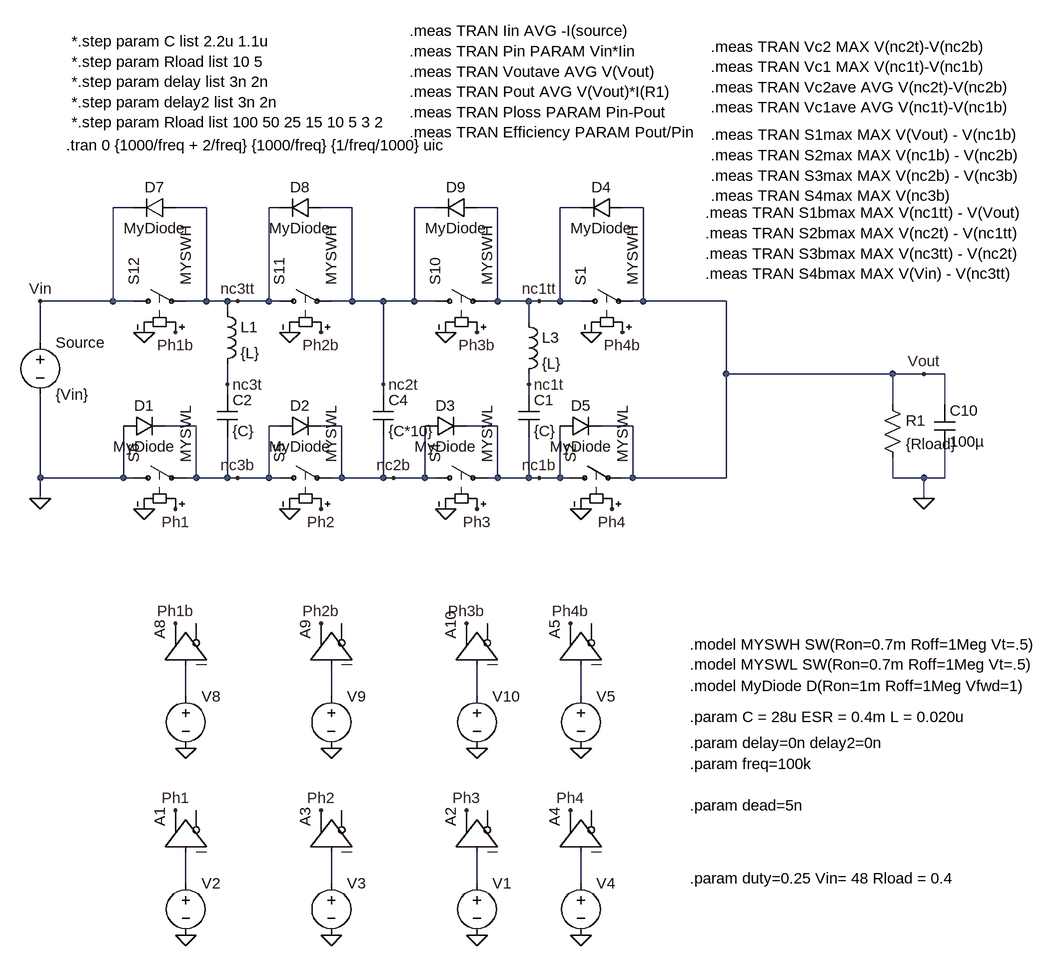
[diagram p0: schematic 5level_48V_distribuated.asc]
5level_48V_distribuated.asc, the LTspice schematic file:
Version 4
SHEET 1 1904 1428
WIRE -1152 -64 -1184 -64
WIRE -1040 -64 -1088 -64
WIRE -928 -64 -944 -64
WIRE -816 -64 -864 -64
WIRE -688 -64 -720 -64
WIRE -592 -64 -624 -64
WIRE -464 -64 -496 -64
WIRE -368 -64 -400 -64
WIRE -1184 80 -1184 -64
WIRE -1184 80 -1296 80
WIRE -1152 80 -1184 80
WIRE -1040 80 -1040 -64
WIRE -1040 80 -1072 80
WIRE -1008 80 -1040 80
WIRE -992 80 -1008 80
WIRE -944 80 -944 -64
WIRE -944 80 -992 80
WIRE -928 80 -944 80
WIRE -816 80 -816 -64
WIRE -816 80 -848 80
WIRE -768 80 -816 80
WIRE -720 80 -720 -64
WIRE -720 80 -768 80
WIRE -688 80 -720 80
WIRE -592 80 -592 -64
WIRE -592 80 -608 80
WIRE -544 80 -592 80
WIRE -528 80 -544 80
WIRE -496 80 -496 -64
WIRE -496 80 -528 80
WIRE -464 80 -496 80
WIRE -368 80 -368 -64
WIRE -368 80 -384 80
WIRE -240 80 -368 80
WIRE -1008 96 -1008 80
WIRE -544 112 -544 80
WIRE -1296 144 -1296 80
WIRE -240 192 -240 80
WIRE 16 192 -240 192
WIRE 64 192 16 192
WIRE 96 192 64 192
WIRE -1008 208 -1008 176
WIRE -768 208 -768 80
WIRE -544 208 -544 192
WIRE -1008 224 -1008 208
WIRE -768 224 -768 208
WIRE -544 224 -544 208
WIRE 16 240 16 192
WIRE 96 240 96 192
WIRE -1056 272 -1104 272
WIRE -928 272 -944 272
WIRE -832 272 -864 272
WIRE -592 272 -640 272
WIRE -384 272 -432 272
WIRE -1296 352 -1296 224
WIRE -1168 352 -1168 272
WIRE -1168 352 -1296 352
WIRE -1152 352 -1168 352
WIRE -1056 352 -1056 272
WIRE -1056 352 -1072 352
WIRE -1008 352 -1008 288
WIRE -1008 352 -1056 352
WIRE -992 352 -1008 352
WIRE -944 352 -944 272
WIRE -944 352 -992 352
WIRE -928 352 -944 352
WIRE -832 352 -832 272
WIRE -832 352 -848 352
WIRE -768 352 -768 288
WIRE -768 352 -832 352
WIRE -752 352 -768 352
WIRE -704 352 -704 272
WIRE -704 352 -752 352
WIRE -688 352 -704 352
WIRE -592 352 -592 272
WIRE -592 352 -608 352
WIRE -544 352 -544 288
WIRE -544 352 -592 352
WIRE -528 352 -544 352
WIRE -496 352 -496 272
WIRE -496 352 -528 352
WIRE -480 352 -496 352
WIRE -384 352 -384 272
WIRE -384 352 -400 352
WIRE -240 352 -240 192
WIRE -240 352 -384 352
WIRE 16 352 16 320
WIRE 64 352 16 352
WIRE 96 352 96 304
WIRE 96 352 64 352
WIRE -1296 384 -1296 352
WIRE 64 384 64 352
WIRE -1072 688 -1072 640
WIRE -848 688 -848 640
WIRE -624 688 -624 640
WIRE -464 688 -464 640
WIRE -1072 976 -1072 928
WIRE -848 976 -848 928
WIRE -624 976 -624 928
WIRE -464 976 -464 928
FLAG -1072 1056 0
FLAG -1088 864 Ph1
FLAG -1296 80 Vin
FLAG -624 128 Ph3b
FLAG -864 128 Ph2b
FLAG -1088 128 Ph1b
FLAG -1136 128 0
FLAG -912 128 0
FLAG -672 128 0
FLAG -848 1056 0
FLAG -864 864 Ph2
FLAG -624 400 Ph3
FLAG -864 400 Ph2
FLAG -1088 400 Ph1
FLAG -1136 400 0
FLAG -912 400 0
FLAG -672 400 0
FLAG 64 384 0
FLAG -1296 384 0
FLAG -624 1056 0
FLAG -640 864 Ph3
FLAG -1072 768 0
FLAG -1088 576 Ph1b
FLAG -848 768 0
FLAG -864 576 Ph2b
FLAG -624 768 0
FLAG -640 576 Ph3b
FLAG -992 80 nc3tt
FLAG -992 352 nc3b
FLAG -752 352 nc2b
FLAG -400 128 Ph4b
FLAG -448 128 0
FLAG -416 400 Ph4
FLAG -464 400 0
FLAG -528 80 nc1tt
FLAG -528 352 nc1b
FLAG -464 1056 0
FLAG -480 864 Ph4
FLAG -464 768 0
FLAG -480 576 Ph4b
FLAG 64 192 Vout
FLAG -1008 208 nc3t
FLAG -768 208 nc2t
FLAG -544 208 nc1t
SYMBOL voltage -1072 960 R0
WINDOW 123 0 0 Left 2
WINDOW 39 0 0 Left 2
WINDOW 3 24 96 Invisible 2
SYMATTR Value PULSE(0 1 0 1p 1p {1/freq*(1-duty)} {1/freq})
SYMATTR InstName V2
SYMBOL Digital\\buf -1136 928 R270
SYMATTR InstName A1
SYMBOL voltage -1296 128 R0
WINDOW 123 0 0 Left 2
WINDOW 39 0 0 Left 2
SYMATTR InstName Source
SYMATTR Value {Vin}
SYMBOL sw -704 80 R270
SYMATTR InstName S10
SYMATTR Value MYSWH
SYMBOL sw -944 80 R270
SYMATTR InstName S11
SYMATTR Value MYSWH
SYMBOL sw -1168 80 R270
SYMATTR InstName S12
SYMATTR Value MYSWH
SYMBOL voltage -848 960 R0
WINDOW 123 0 0 Left 2
WINDOW 39 0 0 Left 2
WINDOW 3 24 96 Invisible 2
SYMATTR Value PULSE(0 1 {1/freq/4+delay} 1p 1p {1/freq*(1-duty)-delay+delay2} {1/freq})
SYMATTR InstName V3
SYMBOL Digital\\buf -912 928 R270
SYMATTR InstName A3
SYMBOL sw -704 352 R270
SYMATTR InstName S4
SYMATTR Value MYSWL
SYMBOL sw -944 352 R270
SYMATTR InstName S5
SYMATTR Value MYSWL
SYMBOL sw -1168 352 R270
SYMATTR InstName S6
SYMATTR Value MYSWL
SYMBOL cap -1024 224 R0
SYMATTR InstName C2
SYMATTR Value {C}
SYMATTR SpiceLine Rser={ESR}
SYMATTR SpiceLine2 IC={Vin/3*1}
SYMBOL cap -784 224 R0
SYMATTR InstName C4
SYMATTR Value {C*10}
SYMATTR SpiceLine Rser={ESR}
SYMATTR SpiceLine2 IC={Vin/3*2}
SYMBOL res 0 224 R0
SYMATTR InstName R1
SYMATTR Value {Rload}
SYMBOL cap 80 240 R0
SYMATTR InstName C10
SYMATTR Value 100µ
SYMATTR SpiceLine IC={Vin*duty}
SYMATTR SpiceLine2 Rser={ESR}
SYMBOL voltage -624 960 R0
WINDOW 123 0 0 Left 2
WINDOW 39 0 0 Left 2
WINDOW 3 24 96 Invisible 2
SYMATTR Value PULSE(0 1 {2/freq/4} 1p 1p {1/freq*(1-duty)} {1/freq})
SYMATTR InstName V1
SYMBOL Digital\\buf -688 928 R270
SYMATTR InstName A2
SYMBOL voltage -1072 672 R0
WINDOW 123 0 0 Left 2
WINDOW 39 0 0 Left 2
WINDOW 3 24 96 Invisible 2
SYMATTR Value PULSE(0 1 {1/freq*(1-duty)+dead+delay} 1p 1p {1/freq*duty-dead*2-delay+delay2} {1/freq})
SYMATTR InstName V8
SYMBOL Digital\\buf -1136 640 R270
SYMATTR InstName A8
SYMBOL voltage -848 672 R0
WINDOW 123 0 0 Left 2
WINDOW 39 0 0 Left 2
WINDOW 3 24 96 Invisible 2
SYMATTR Value PULSE(0 1 {1/freq/4+1/freq*(1-duty)+dead} 1p 1p {1/freq*duty-dead*2} {1/freq})
SYMATTR InstName V9
SYMBOL Digital\\buf -912 640 R270
SYMATTR InstName A9
SYMBOL voltage -624 672 R0
WINDOW 123 0 0 Left 2
WINDOW 39 0 0 Left 2
WINDOW 3 24 44 Invisible 2
SYMATTR Value PULSE(0 1 {2/freq/4+1/freq*(1-duty)+dead+delay} 1p 1p {1/freq*duty-dead*2-delay+delay2} {1/freq})
SYMATTR InstName V10
SYMBOL Digital\\buf -688 640 R270
SYMATTR InstName A10
SYMBOL diode -1168 288 R270
WINDOW 0 32 32 VTop 2
WINDOW 3 0 32 VBottom 2
SYMATTR InstName D1
SYMATTR Value MyDiode
SYMBOL diode -928 288 R270
WINDOW 0 32 32 VTop 2
WINDOW 3 0 32 VBottom 2
SYMATTR InstName D2
SYMATTR Value MyDiode
SYMBOL diode -704 288 R270
WINDOW 0 32 32 VTop 2
WINDOW 3 0 32 VBottom 2
SYMATTR InstName D3
SYMATTR Value MyDiode
SYMBOL diode -1088 -80 R90
WINDOW 0 0 32 VBottom 2
WINDOW 3 32 32 VTop 2
SYMATTR InstName D7
SYMATTR Value MyDiode
SYMBOL diode -864 -80 R90
WINDOW 0 0 32 VBottom 2
WINDOW 3 32 32 VTop 2
SYMATTR InstName D8
SYMATTR Value MyDiode
SYMBOL diode -624 -80 R90
WINDOW 0 0 32 VBottom 2
WINDOW 3 32 32 VTop 2
SYMATTR InstName D9
SYMATTR Value MyDiode
SYMBOL sw -480 80 R270
SYMATTR InstName S1
SYMATTR Value MYSWH
SYMBOL diode -400 -80 R90
WINDOW 0 0 32 VBottom 2
WINDOW 3 32 32 VTop 2
SYMATTR InstName D4
SYMATTR Value MyDiode
SYMBOL sw -496 352 R270
SYMATTR InstName S2
SYMATTR Value MYSWL
SYMBOL diode -496 288 R270
WINDOW 0 32 32 VTop 2
WINDOW 3 0 32 VBottom 2
SYMATTR InstName D5
SYMATTR Value MyDiode
SYMBOL cap -560 224 R0
SYMATTR InstName C1
SYMATTR Value {C}
SYMATTR SpiceLine Rser={ESR}
SYMATTR SpiceLine2 IC={Vin/3*2}
SYMBOL voltage -464 960 R0
WINDOW 123 0 0 Left 2
WINDOW 39 0 0 Left 2
WINDOW 3 24 96 Invisible 2
SYMATTR Value PULSE(0 1 {3/freq/4} 1p 1p {1/freq*(1-duty)} {1/freq})
SYMATTR InstName V4
SYMBOL Digital\\buf -528 928 R270
SYMATTR InstName A4
SYMBOL voltage -464 672 R0
WINDOW 123 0 0 Left 2
WINDOW 39 0 0 Left 2
WINDOW 3 24 44 Invisible 2
SYMATTR Value PULSE(0 1 {3/freq/4+1/freq*(1-duty)+dead+delay} 1p 1p {1/freq*duty-dead*2-delay+delay2} {1/freq})
SYMATTR InstName V5
SYMBOL Digital\\buf -528 640 R270
SYMATTR InstName A5
SYMBOL ind -1024 80 R0
SYMATTR InstName L1
SYMATTR Value {L}
SYMATTR SpiceLine Rser=0.2m Rpar=1k
SYMATTR SpiceLine2 ic = {Vin*duty/Rload}
SYMBOL ind -560 96 R0
SYMATTR InstName L3
SYMATTR Value {L}
SYMATTR SpiceLine Rser=0.2m Rpar=1k
SYMATTR SpiceLine2 ic = {Vin*duty/Rload}
TEXT -1256 -160 Left 2 !.tran 0 {1000/freq + 2/freq} {1000/freq} {1/freq/1000} uic
TEXT -296 608 Left 2 !.model MYSWH SW(Ron=0.7m Roff=1Meg Vt=.5)\n.model MYSWL SW(Ron=0.7m Roff=1Meg Vt=.5)
TEXT -296 672 Left 2 !.model MyDiode D(Ron=1m Roff=1Meg Vfwd=1)
TEXT -296 760 Left 2 !.param delay=0n delay2=0n
TEXT -296 792 Left 2 !.param freq=100k
TEXT -296 968 Left 2 !.param duty=0.25 Vin= 48 Rload = 0.4
TEXT -296 856 Left 2 !.param dead=5n
TEXT -296 720 Left 2 !.param C = 28u ESR = 0.4m L = 0.020u
TEXT -264 -176 Left 2 !.meas TRAN S1max MAX V(Vout) - V(nc1b)\n.meas TRAN S2max MAX V(nc1b) - V(nc2b)\n.meas TRAN S3max MAX V(nc2b) - V(nc3b)\n.meas TRAN S4max MAX V(nc3b)
TEXT -264 -312 Left 2 !.meas TRAN Vc2 MAX V(nc2t)-V(nc2b)\n.meas TRAN Vc1 MAX V(nc1t)-V(nc1b)\n.meas TRAN Vc2ave AVG V(nc2t)-V(nc2b)\n.meas TRAN Vc1ave AVG V(nc1t)-V(nc1b)
TEXT -272 -56 Left 2 !.meas TRAN S1bmax MAX V(nc1tt) - V(Vout) \n.meas TRAN S2bmax MAX V(nc2t) - V(nc1tt) \n.meas TRAN S3bmax MAX V(nc3tt) - V(nc2t)\n.meas TRAN S4bmax MAX V(Vin) - V(nc3tt)
TEXT -1248 -320 Left 2 !*.step param C list 2.2u 1.1u\n*.step param Rload list 10 5\n*.step param delay list 3n 2n\n*.step param delay2 list 3n 2n\n*.step param Rload list 100 50 25 15 10 5 3 2
TEXT -728 -336 Left 2 !.meas TRAN Iin AVG -I(source)\n.meas TRAN Pin PARAM Vin*Iin\n.meas TRAN Voutave AVG V(Vout)\n.meas TRAN Pout AVG V(Vout)*I(R1)\n.meas TRAN Ploss PARAM Pin-Pout\n.meas TRAN Efficiency PARAM Pout/Pin

The netlist it stands for:
* 5level_48V_distribuated.asc
V2 N005 0 PULSE(0 1 0 1p 1p {1/freq*(1-duty)} {1/freq})
A1 N005 0 0 0 0 0 Ph1 0 BUF
V§Source Vin 0 {Vin}
S10 nc2t nc1tt Ph3b 0 MYSWH
S11 nc3tt nc2t Ph2b 0 MYSWH
S12 Vin nc3tt Ph1b 0 MYSWH
V3 N006 0 PULSE(0 1 {1/freq/4+delay} 1p 1p {1/freq*(1-duty)-delay+delay2} {1/freq})
A3 N006 0 0 0 0 0 Ph2 0 BUF
S4 nc2b nc1b Ph3 0 MYSWL
S5 nc3b nc2b Ph2 0 MYSWL
S6 0 nc3b Ph1 0 MYSWL
C2 nc3t nc3b {C} Rser={ESR} IC={Vin/3*1}
C4 nc2t nc2b {C*10} Rser={ESR} IC={Vin/3*2}
R1 Vout 0 {Rload}
C10 Vout 0 100µ IC={Vin*duty} Rser={ESR}
V1 N007 0 PULSE(0 1 {2/freq/4} 1p 1p {1/freq*(1-duty)} {1/freq})
A2 N007 0 0 0 0 0 Ph3 0 BUF
V8 N001 0 PULSE(0 1 {1/freq*(1-duty)+dead+delay} 1p 1p {1/freq*duty-dead*2-delay+delay2} {1/freq})
A8 N001 0 0 0 0 0 Ph1b 0 BUF
V9 N002 0 PULSE(0 1 {1/freq/4+1/freq*(1-duty)+dead} 1p 1p {1/freq*duty-dead*2} {1/freq})
A9 N002 0 0 0 0 0 Ph2b 0 BUF
V10 N003 0 PULSE(0 1 {2/freq/4+1/freq*(1-duty)+dead+delay} 1p 1p {1/freq*duty-dead*2-delay+delay2} {1/freq})
A10 N003 0 0 0 0 0 Ph3b 0 BUF
D1 0 nc3b MyDiode
D2 nc3b nc2b MyDiode
D3 nc2b nc1b MyDiode
D7 nc3tt Vin MyDiode
D8 nc2t nc3tt MyDiode
D9 nc1tt nc2t MyDiode
S1 nc1tt Vout Ph4b 0 MYSWH
D4 Vout nc1tt MyDiode
S2 nc1b Vout Ph4 0 MYSWL
D5 nc1b Vout MyDiode
C1 nc1t nc1b {C} Rser={ESR} IC={Vin/3*2}
V4 N008 0 PULSE(0 1 {3/freq/4} 1p 1p {1/freq*(1-duty)} {1/freq})
A4 N008 0 0 0 0 0 Ph4 0 BUF
V5 N004 0 PULSE(0 1 {3/freq/4+1/freq*(1-duty)+dead+delay} 1p 1p {1/freq*duty-dead*2-delay+delay2} {1/freq})
A5 N004 0 0 0 0 0 Ph4b 0 BUF
L1 nc3tt nc3t {L} Rser=0.2m Rpar=1k ic = {Vin*duty/Rload}
L3 nc1tt nc1t {L} Rser=0.2m Rpar=1k ic = {Vin*duty/Rload}
.model D D
.lib standard.dio
.tran 0 {1000/freq + 2/freq} {1000/freq} {1/freq/1000} uic
.model MYSWH SW(Ron=0.7m Roff=1Meg Vt=.5)
.model MYSWL SW(Ron=0.7m Roff=1Meg Vt=.5)
.model MyDiode D(Ron=1m Roff=1Meg Vfwd=1)
.param delay=0n delay2=0n
.param freq=100k
.param duty=0.25 Vin= 48 Rload = 0.4
.param dead=5n
.param C = 28u ESR = 0.4m L = 0.020u
.meas TRAN S1max MAX V(Vout) - V(nc1b)
.meas TRAN S2max MAX V(nc1b) - V(nc2b)
.meas TRAN S3max MAX V(nc2b) - V(nc3b)
.meas TRAN S4max MAX V(nc3b)
.meas TRAN Vc2 MAX V(nc2t)-V(nc2b)
.meas TRAN Vc1 MAX V(nc1t)-V(nc1b)
.meas TRAN Vc2ave AVG V(nc2t)-V(nc2b)
.meas TRAN Vc1ave AVG V(nc1t)-V(nc1b)
.meas TRAN S1bmax MAX V(nc1tt) - V(Vout)
.meas TRAN S2bmax MAX V(nc2t) - V(nc1tt)
.meas TRAN S3bmax MAX V(nc3tt) - V(nc2t)
.meas TRAN S4bmax MAX V(Vin) - V(nc3tt)
*.step param C list 2.2u 1.1u
*.step param Rload list 10 5
*.step param delay list 3n 2n
*.step param delay2 list 3n 2n
*.step param Rload list 100 50 25 15 10 5 3 2
.meas TRAN Iin AVG -I(source)
.meas TRAN Pin PARAM Vin*Iin
.meas TRAN Voutave AVG V(Vout)
.meas TRAN Pout AVG V(Vout)*I(R1)
.meas TRAN Ploss PARAM Pin-Pout
.meas TRAN Efficiency PARAM Pout/Pin
.backanno
.end